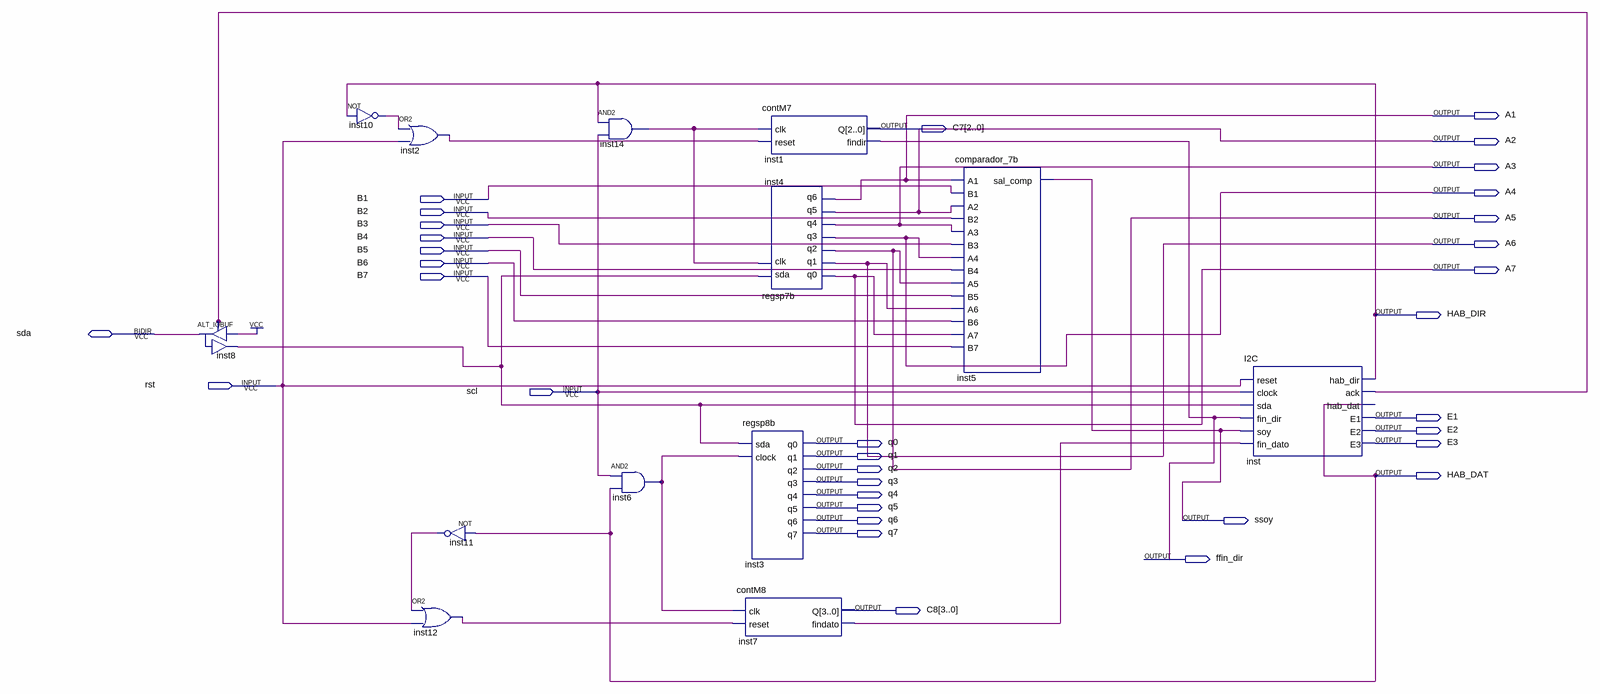
[diagram p0: schematic sheet]
// Quartus schematic i2c_comp.bdf as structural Verilog: 13 symbols, 34 pins
module i2c_comp (
  input  B1,
  input  B2,
  input  B3,
  input  B4,
  input  B5,
  input  B6,
  input  B7,
  input  rst,
  input  scl,
  inout  sda,
  output A1,
  output [2:0] C7,
  output A2,
  output A3,
  output A4,
  output A5,
  output A6,
  output A7,
  output HAB_DIR,
  output E1,
  output E2,
  output q0,
  output E3,
  output q1,
  output q2,
  output HAB_DAT,
  output q3,
  output q4,
  output q5,
  output q6,
  output ssoy,
  output q7,
  output ffin_dir,
  output [3:0] C8
);

  wire inst2_out, inst6_out, inst7_findato, inst8_o, inst10_out, inst11_out, inst12_out, inst14_out, inst_ack;

  ALT_IOBUF inst8 (.i(1'b1), .oe(inst_ack), .o(inst8_o), .io(sda));
  not inst10 (inst10_out, HAB_DIR);
  or inst2 (inst2_out, inst10_out, rst);
  not inst11 (inst11_out, HAB_DAT);
  or inst12 (inst12_out, inst11_out, rst);
  and inst14 (inst14_out, HAB_DIR, scl);
  and inst6 (inst6_out, scl, HAB_DAT);
  contM7 inst1 (.clk(inst14_out), .reset(inst2_out), .Q(C7), .findir(ffin_dir));
  regsp7b inst4 (.sda(inst8_o), .clk(inst14_out), .q0(A7), .q1(A6), .q2(A5), .q3(A4), .q4(A3), .q5(A2), .q6(A1));
  regsp8b inst3 (
    .sda(inst8_o), .clock(inst6_out), .q0(q0), .q1(q1), .q2(q2), .q3(q3), .q4(q4), .q5(q5), .q6(q6), .q7(q7));
  contM8 inst7 (.clk(inst6_out), .reset(inst12_out), .Q(C8), .findato(inst7_findato));
  comparador_7b inst5 (
    .A1(A1), .B1(B1), .A2(A2), .B2(B2), .A3(A3), .B3(B3), .A4(A4), .B4(B4), .A5(A5), .B5(B5), .A6(A6),
    .B6(B6), .A7(A7), .B7(B7), .sal_comp(ssoy));
  I2C inst (
    .reset(rst), .clock(scl), .sda(inst8_o), .fin_dir(ffin_dir), .soy(ssoy), .fin_dato(inst7_findato),
    .hab_dir(HAB_DIR), .ack(inst_ack), .hab_dat(HAB_DAT), .E1(E1), .E2(E2), .E3(E3));
endmodule
